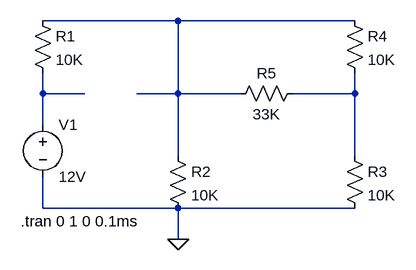
[diagram p0: schematic Thevenin.asc]
Thevenin.asc, the LTspice schematic file:
Version 4
SHEET 1 880 680
WIRE 192 64 -16 64
WIRE 464 64 192 64
WIRE -16 176 -16 144
WIRE 48 176 -16 176
WIRE 192 176 192 64
WIRE 192 176 128 176
WIRE 288 176 192 176
WIRE 464 176 464 144
WIRE 464 176 368 176
WIRE -16 224 -16 176
WIRE 192 272 192 176
WIRE 464 272 464 176
WIRE -16 352 -16 304
WIRE 192 352 -16 352
WIRE 464 352 192 352
WIRE 192 400 192 352
FLAG 192 400 0
SYMBOL res -32 48 R0
SYMATTR InstName R1
SYMATTR Value 10K
SYMBOL res 176 256 R0
SYMATTR InstName R2
SYMATTR Value 10K
SYMBOL res 448 48 R0
SYMATTR InstName R4
SYMATTR Value 10K
SYMBOL res 384 160 R90
WINDOW 0 0 56 VBottom 2
WINDOW 3 32 56 VTop 2
SYMATTR InstName R5
SYMATTR Value 33K
SYMBOL res 448 256 R0
SYMATTR InstName R3
SYMATTR Value 10K
SYMBOL voltage -16 208 R0
WINDOW 123 0 0 Left 0
WINDOW 39 0 0 Left 0
SYMATTR InstName V1
SYMATTR Value 12V
TEXT -50 372 Left 2 !.tran 0 1 0 0.1ms

The netlist it stands for:
* Thevenin.asc
R1 N001 N002 10K
R2 N001 0 10K
R4 N001 N003 10K
R5 N003 N001 33K
R3 N003 0 10K
V1 N002 0 12V
.tran 0 1 0 0.1ms
.backanno
.end